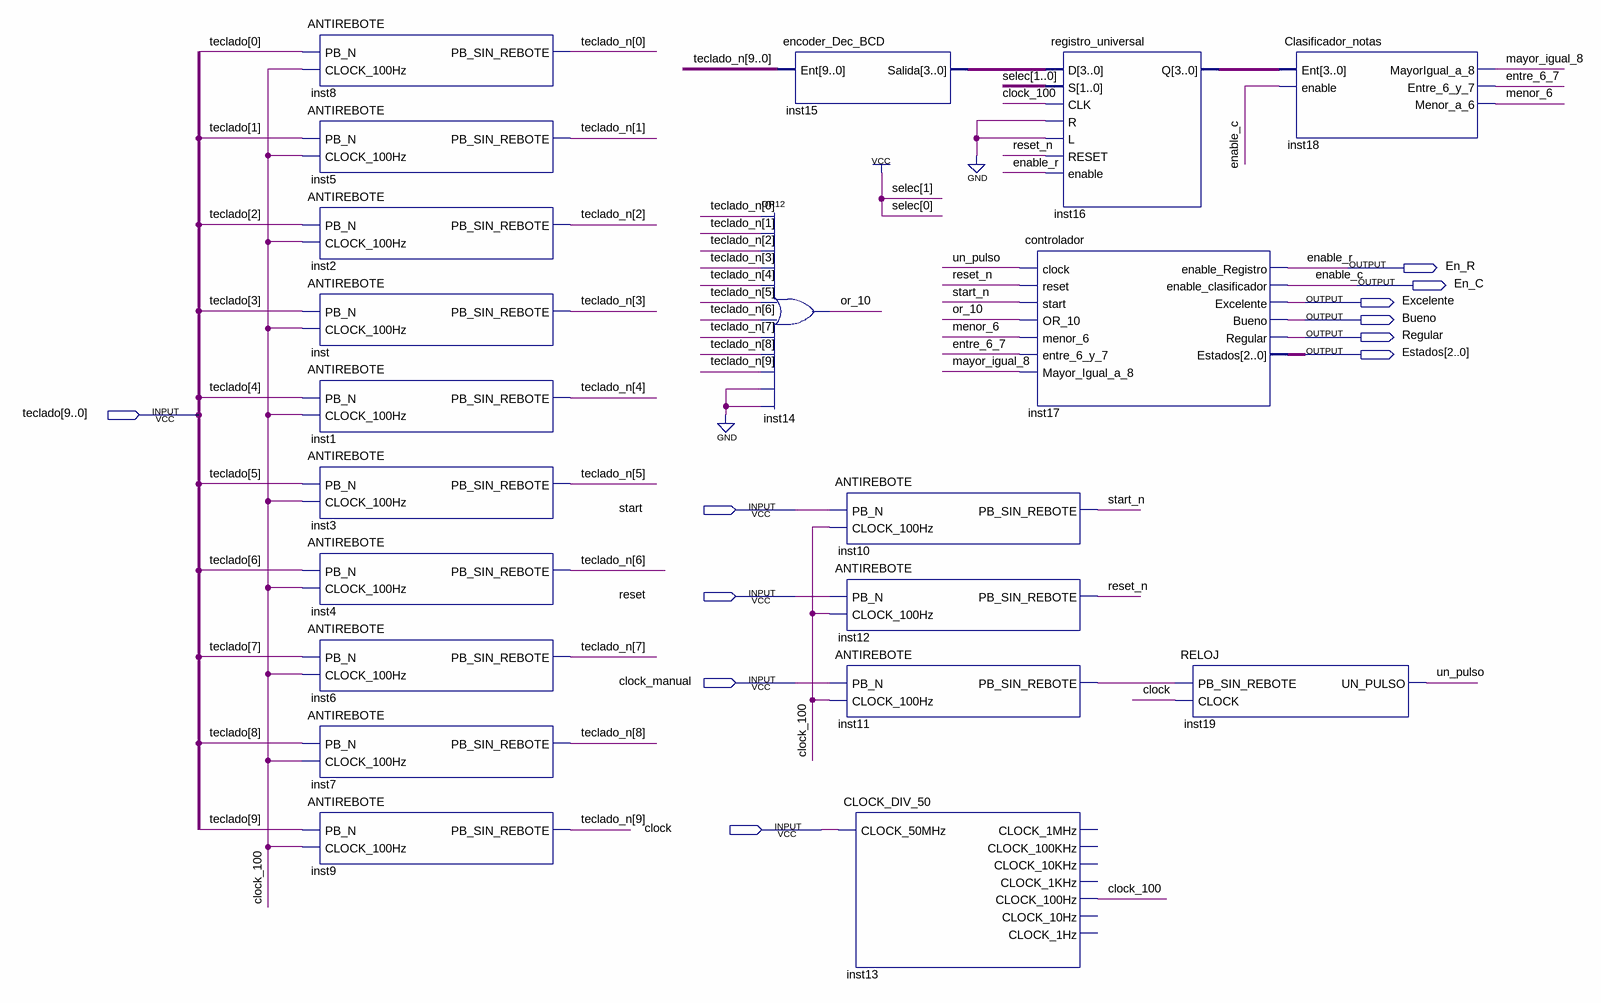
[diagram p0: schematic sheet]
// Quartus schematic ACTIVIDAD5bloques.bdf as structural Verilog: 20 symbols, 11 pins
module ACTIVIDAD5bloques (
  input  [9:0] teclado,
  input  start,
  input  reset,
  input  clock_manual,
  input  clock,
  output En_R,
  output En_C,
  output Excelente,
  output Bueno,
  output Regular,
  output [2:0] Estados
);

  wire clock_100, entre_6_7, inst11_pb_sin_rebote, mayor_igual_8, menor_6, or_10, reset_n, start_n, un_pulso;
  wire [3:0] inst15_salida, inst16_q;
  wire [9:0] teclado_n;

  ANTIREBOTE inst8 (.PB_N(teclado[0]), .CLOCK_100Hz(clock_100), .PB_SIN_REBOTE(teclado_n[0]));
  ANTIREBOTE inst5 (.PB_N(teclado[1]), .CLOCK_100Hz(clock_100), .PB_SIN_REBOTE(teclado_n[1]));
  ANTIREBOTE inst2 (.PB_N(teclado[2]), .CLOCK_100Hz(clock_100), .PB_SIN_REBOTE(teclado_n[2]));
  ANTIREBOTE inst (.PB_N(teclado[3]), .CLOCK_100Hz(clock_100), .PB_SIN_REBOTE(teclado_n[3]));
  ANTIREBOTE inst1 (.PB_N(teclado[4]), .CLOCK_100Hz(clock_100), .PB_SIN_REBOTE(teclado_n[4]));
  ANTIREBOTE inst3 (.PB_N(teclado[5]), .CLOCK_100Hz(clock_100), .PB_SIN_REBOTE(teclado_n[5]));
  ANTIREBOTE inst4 (.PB_N(teclado[6]), .CLOCK_100Hz(clock_100), .PB_SIN_REBOTE(teclado_n[6]));
  ANTIREBOTE inst6 (.PB_N(teclado[7]), .CLOCK_100Hz(clock_100), .PB_SIN_REBOTE(teclado_n[7]));
  ANTIREBOTE inst7 (.PB_N(teclado[8]), .CLOCK_100Hz(clock_100), .PB_SIN_REBOTE(teclado_n[8]));
  ANTIREBOTE inst9 (.PB_N(teclado[9]), .CLOCK_100Hz(clock_100), .PB_SIN_REBOTE(teclado_n[9]));
  encoder_Dec_BCD inst15 (.Ent(teclado_n), .Salida(inst15_salida));
  or inst14 (or_10, teclado_n[0], teclado_n[1], teclado_n[2], teclado_n[3], teclado_n[4], teclado_n[5], teclado_n[6], teclado_n[7], teclado_n[8], teclado_n[9], 1'b0, 1'b0);
  ANTIREBOTE inst10 (.PB_N(start), .CLOCK_100Hz(clock_100), .PB_SIN_REBOTE(start_n));
  ANTIREBOTE inst12 (.PB_N(reset), .CLOCK_100Hz(clock_100), .PB_SIN_REBOTE(reset_n));
  ANTIREBOTE inst11 (.PB_N(clock_manual), .CLOCK_100Hz(clock_100), .PB_SIN_REBOTE(inst11_pb_sin_rebote));
  CLOCK_DIV_50 inst13 (
    .CLOCK_50MHz(clock), .CLOCK_100Hz(clock_100));  // open: CLOCK_1MHz, CLOCK_100KHz, CLOCK_10KHz, CLOCK_1KHz, CLOCK_10Hz, CLOCK_1Hz
  registro_universal inst16 (
    .D(inst15_salida), .S(2'b11), .CLK(clock_100), .R(1'b0), .L(1'b0), .RESET(reset_n), .enable(En_R),
    .Q(inst16_q));
  controlador inst17 (
    .clock(un_pulso), .reset(reset_n), .start(start_n), .OR_10(or_10), .menor_6(menor_6),
    .entre_6_y_7(entre_6_7), .Mayor_Igual_a_8(mayor_igual_8), .enable_Registro(En_R),
    .enable_clasificador(En_C), .Excelente(Excelente), .Bueno(Bueno), .Regular(Regular), .Estados(Estados));
  RELOJ inst19 (.PB_SIN_REBOTE(inst11_pb_sin_rebote), .CLOCK(clock), .UN_PULSO(un_pulso));
  Clasificador_notas inst18 (
    .Ent(inst16_q), .enable(En_C), .MayorIgual_a_8(mayor_igual_8), .Entre_6_y_7(entre_6_7),
    .Menor_a_6(menor_6));

  // Other names for the same wires on the sheet: enable_c = En_C; enable_r = En_R
endmodule
